# EAGLE design Q1 EAGLE BRD (EAGLE 9.6.0)
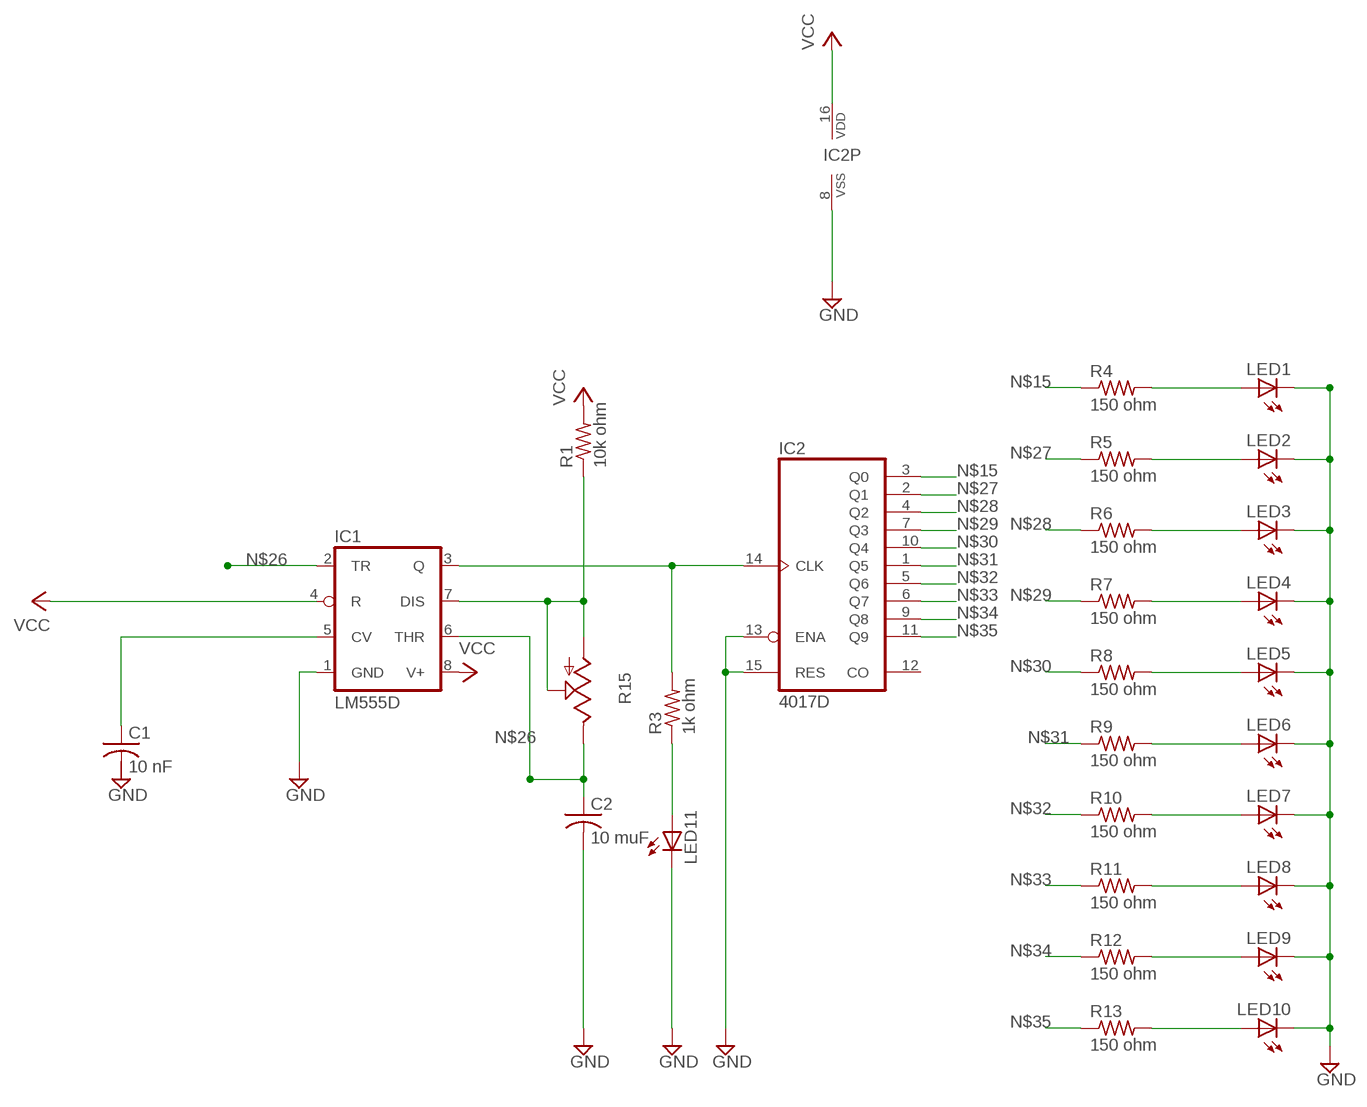
[diagram p0: schematic, sheet 1]

## Parts
C1  10 nF  C-USC0805  [C0805]
C2  10 muF  C-USC0805  [C0805]
IC1  LM555D  [SO08]
IC2  4017D  [SO16]
LED1  LED5MM  [LED5MM]
LED2  LED5MM  [LED5MM]
LED3  LED5MM  [LED5MM]
LED4  LED5MM  [LED5MM]
LED5  LED5MM  [LED5MM]
LED6  LED5MM  [LED5MM]
LED7  LED5MM  [LED5MM]
LED8  LED5MM  [LED5MM]
LED9  LED5MM  [LED5MM]
LED10  LED5MM  [LED5MM]
LED11  LED5MM  [LED5MM]
R1  10k ohm  R-US_M1206  [M1206]
R3  1k ohm  R-US_M1206  [M1206]
R4  150 ohm  R-US_M1206  [M1206]
R5  150 ohm  R-US_M1206  [M1206]
R6  150 ohm  R-US_M1206  [M1206]
R7  150 ohm  R-US_M1206  [M1206]
R8  150 ohm  R-US_M1206  [M1206]
R9  150 ohm  R-US_M1206  [M1206]
R10  150 ohm  R-US_M1206  [M1206]
R11  150 ohm  R-US_M1206  [M1206]
R12  150 ohm  R-US_M1206  [M1206]
R13  150 ohm  R-US_M1206  [M1206]
R15  TRIM_US-S63X  [S63X]

## Nets
GND: C2.2 IC1.1(GND) IC2.8(VSS) IC2.13(ENA) IC2.15(RES) LED1.K(C) LED2.K(C) LED3.K(C) LED4.K(C) LED5.K(C) LED6.K(C) LED7.K(C) LED8.K(C) LED9.K(C) LED10.K(C) LED11.K(C)
N$1: C1.1 IC1.5(CV)
N$3: LED11.A R3.1
N$4: LED1.A R4.2
N$5: LED2.A R5.2
N$6: LED3.A R6.2
N$7: LED4.A R7.2
N$8: LED5.A R8.2
N$9: LED6.A R9.2
N$10: LED7.A R10.2
N$11: LED8.A R11.2
N$12: LED9.A R12.2
N$13: LED10.A R13.2
N$14: IC1.7(DIS) R1.1 R15.A R15.S
N$15: IC2.3(Q0) R4.1
N$25: IC1.3(Q) IC2.14(CLK) R3.2
N$26: C2.1 IC1.2(TR) IC1.6(THR) R15.E
N$27: IC2.2(Q1) R5.1
N$28: IC2.4(Q2) R6.1
N$29: IC2.7(Q3) R7.1
N$30: IC2.10(Q4) R8.1
N$31: IC2.1(Q5) R9.1
N$32: IC2.5(Q6) R10.1
N$33: IC2.6(Q7) R11.1
N$34: IC2.9(Q8) R12.1
N$35: IC2.11(Q9) R13.1
VCC: IC1.4(R) IC1.8(V+) IC2.16(VDD) R1.2
Unconnected: C1.2 IC2.12(CO)

## Library data of the parts
C1 C2 = rcl:C-US: CAPACITOR, American symbol; SPICEPREFIX: C
IC1 = linear:*555: TIMER
IC2 = 40xx:4017: COUNTER/DIVIDER
LED1-LED11 = adafruit:LED: LED OSRAM: - CHIPLED LG R971, LG N971, LY N971, LG Q971, LY Q971, LO R971, LY R971 LH N974, LH R974 LS Q976, LO Q976, LY Q976 LO Q996 - Hyper CHIPLED LW Q18S LB Q993, LB Q99A, LB R99A - SideLED LS A670, LO A670, LY A670, LG A670, LP A670 LB A673, LV A673, LT A673, LW A673 LH A674 LY A675 LS A676, LA A676, LO A676, LY A676, LW A676 LS A679, LY A679, LG A679 - Hyper Micro SIDELED® LS Y876, LA Y876, LO Y876, LY Y876 LT Y87S - SmartLED LW L88C, LW L88S LB L89C, LB L89S, LG L890 LS L89K, LO L89K, LY L89K LS L896, LA L896, LO L896, LY L896 - TOPLED LS T670, LO T670, LY T670, LG T670, LP T670 LSG T670, LSP T670, LSY T670, LOP T670, LYG T670 LG T671, LOG T671, LSG T671 LB T673, LV T673, LT T673, LW T673 LH T674 LS T676, LA T676, LO T676, LY T676, LB T676, LH T676, LSB T676, LW T676 LB T67C, LV T67C, LT T67C, LS T67K, LO T67K, LY T67K, LW E67C LS E67B, LA E67B, LO E67B, LY E67B, LB E67C, LV E67C, LT E67C LW T67C LS T679, LY T679, LG T679 LS T770, LO T770, LY T770, LG T770, LP T770 LB T773, LV T773, LT T773, LW T773 LH T774 LS E675, LA E675, LY E675, LS T675 LS T776, LA T776, LO T776, LY T776, LB T776 LHGB T686 LT T68C, LB T68C - Hyper Mini TOPLED® LB M676 - Mini TOPLED Santana® LG M470 LS M47K, LO M47K, LY M47K Source: http://www.osram.convergy.de/
R1 R3-R13 = adafruit:R-US_: RESISTOR, American symbol
R15 = pot:TRIM_US-: POTENTIOMETER

## Board
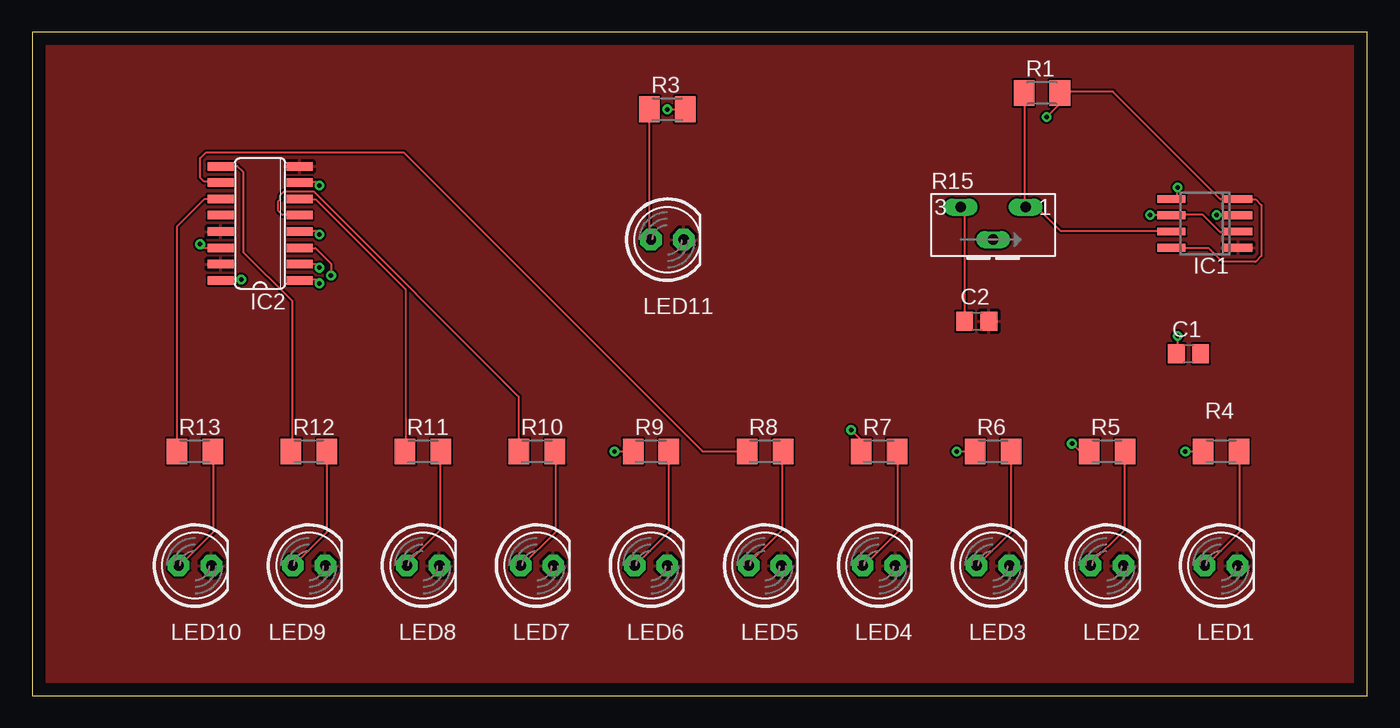
[diagram p1: board, top side]
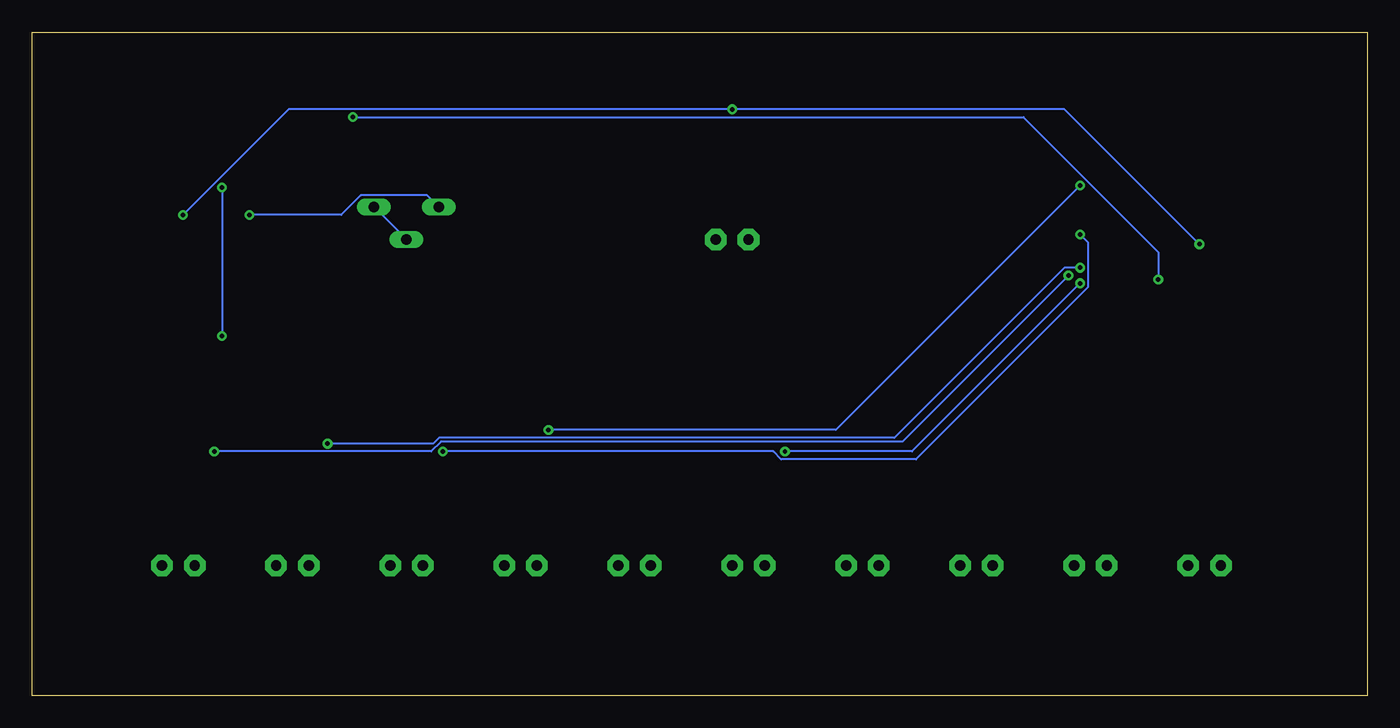
[diagram p2: board, bottom side, seen from below]

Size 104.12 x 51.74 mm. Coordinates in mm from the lower left corner, seen from the top.
Outline: 0,0 104.12,0 104.12,51.74 0,51.74 0,0
Copper layers (1*16): Top 0.035mm / dielectric 1.5mm / Bottom 0.035mm
Design rules "default": minimum track width 6mil, minimum drill 0.35mm, track to track 6mil, track to pad 6mil, pad to pad 6mil, via to via 6mil, smd to smd 6mil, copper to edge 40mil, drill to drill 6mil, minimum pad ring 10mil, minimum via ring 8mil, stop-mask expansion 4mil, vias tented up to drill 0mil, thermal gap 10mil

### Footprints (pad centres in the part's own frame; a part is rotated, then mirrored left to right if it is on the bottom)
C0805 = smd 1.3 x 1.5: 1 -0.95,0; 2 0.95,0
SO08 = smd 0.6 x 2.2: 1 -1.905,-2.6; 2 -0.635,-2.6; 3 0.635,-2.6; 4 1.905,-2.6; 5 1.905,2.6; 6 0.635,2.6; 7 -0.635,2.6; 8 -1.905,2.6
SO16 = smd 0.66 x 2.032: 1 -4.445,-3.073; 2 -3.175,-3.073; 3 -1.905,-3.073; 4 -0.635,-3.073; 5 0.635,-3.073; 6 1.905,-3.073; 7 3.175,-3.073; 8 4.445,-3.073; 9 4.445,3.073; 10 3.175,3.073; 11 1.905,3.073; 12 0.635,3.073; 13 -0.635,3.073; 14 -1.905,3.073; 15 -3.175,3.073; 16 -4.445,3.073
LED5MM = drill 0.813 pad 1.676 octagon: A -1.27,0; K 1.27,0
M1206 = smd 1.6 x 2: 1 -1.4,0; 2 1.4,0
S63X = drill 0.813 long: A 2.54,0; E -2.54,0; S 0,-2.54

### Placement (x,y rotation side)
C1  90.17,26.67 0 top
C2  73.66,29.21 0 top
IC1  91.44,36.83 90 top
IC2  17.78,36.83 90 top
LED1  92.71,10.16 0 top
LED2  83.82,10.16 0 top
LED3  74.93,10.16 0 top
LED4  66.04,10.16 0 top
LED5  57.15,10.16 0 top
LED6  48.26,10.16 0 top
LED7  39.37,10.16 0 top
LED8  30.48,10.16 0 top
LED9  21.59,10.16 0 top
LED10  12.7,10.16 0 top
LED11  49.53,35.56 0 top
R1  78.74,46.99 0 top
R3  49.53,45.72 0 top
R4  92.71,19.05 0 top
R5  83.82,19.05 0 top
R6  74.93,19.05 0 top
R7  66.04,19.05 0 top
R8  57.15,19.05 0 top
R9  48.26,19.05 0 top
R10  39.37,19.05 0 top
R11  30.48,19.05 0 top
R12  21.59,19.05 0 top
R13  12.7,19.05 0 top
R15  74.93,38.1 0 top

### Tracks (layer width: path | path; a pad name or v marks a point on that pad's centre or on a via)
GND
  pour Top: 0,52.07 104.14,52.07 104.14,0 0,0
N$1  (via drill 0.35)
  Top 0.152: v89.31,28.04 89.31,26.67 C1.1 | v89.31,39.62 89.31,39.01 89.15,38.86 88.85,38.86 IC1.5
  Bottom 0.152: v89.31,39.62 v89.31,28.04
N$3
  Top 0.152: R3.1 48.16,45.72 48.16,35.66 LED11.A
N$4
  Top 0.152: R4.2 94.18,19.05 94.18,12.8 91.44,10.06 LED1.A
N$5
  Top 0.152: R5.2 85.19,19.05 85.19,12.95 82.45,10.21 LED2.A
N$6
  Top 0.152: R6.2 76.35,19.05 76.35,12.8 73.76,10.21 LED3.A
N$7
  Top 0.152: R7.2 67.51,19.05 67.51,12.8 64.77,10.06 LED4.A
N$8
  Top 0.152: R8.2 58.52,19.05 58.52,12.95 55.78,10.21 LED5.A
N$9
  Top 0.152: R9.2 49.68,19.05 49.68,12.8 47.09,10.21 LED6.A
N$10
  Top 0.152: R10.2 40.84,19.05 40.84,12.8 38.1,10.06 LED7.A
N$11
  Top 0.152: R11.2 31.85,19.05 31.85,12.95 29.11,10.21 LED8.A
N$12
  Top 0.152: R12.2 23.01,19.05 23.01,12.8 20.42,10.21 LED9.A
N$13
  Top 0.152: R13.2 14.17,19.05 14.17,12.8 11.43,10.06 LED10.A
N$14
  Top 0.152: R1.1 77.42,46.94 77.42,38.1 R15.A 78.33,38.1 80.16,36.27 88.7,36.27 IC1.7
  Bottom 0.152: R15.S 74.98,35.66 77.42,38.1 R15.A
N$15  (via drill 0.35)
  Top 0.152: v89.92,19.05 R4.1 | v23.32,32.77 23.32,33.68 22.1,34.9 20.88,34.9 IC2.3
  Bottom 0.152: v89.92,19.05 73,19.05 72.24,19.81 36.27,19.81 v23.32,32.77
N$25  (via drill 0.35)
  Top 0.152: v49.53,45.72 R3.2 | v13.11,35.2 13.41,34.9 14.63,34.9 IC2.14 | v92.35,37.49 94.03,37.49 IC1.3
  Bottom 0.152: v13.11,35.2 23.62,45.72 v49.53,45.72 84.12,45.72 v92.35,37.49
N$26  (via drill 0.35)
  Top 0.152: IC1.2 94.03,36.12 92.66,36.12 91.29,37.49 88.85,37.49 IC1.6 88.7,37.49 v87.17,37.49 | R15.E 72.69,37.8 72.69,29.26 C2.1
  Bottom 0.152: v87.17,37.49 80.01,37.49 78.49,39.01 73.3,39.01 R15.E
N$27  (via drill 0.35)
  Top 0.152: R5.1 81.69,19.05 v81.08,19.66 | v22.4,33.38 22.1,33.68 20.88,33.68 IC2.2
  Bottom 0.152: v81.08,19.66 72.85,19.66 72.39,20.12 36.88,20.12 23.62,33.38 v22.4,33.38
N$28  (via drill 0.35)
  Top 0.152: v72.08,19.05 R6.1 | v22.4,35.97 22.1,36.27 20.88,36.27 IC2.4
  Bottom 0.152: v72.08,19.05 46.33,19.05 45.72,18.44 35.2,18.44 21.79,31.85 21.79,35.36 v22.4,35.97
N$29  (via drill 0.35)
  Top 0.152: v63.86,20.73 64.62,19.96 64.62,19.05 R7.1 | v22.4,39.78 22.1,40.08 20.88,40.08 IC2.7
  Bottom 0.152: v63.86,20.73 41.45,20.73 v22.4,39.78
N$30
  Top 0.152: R8.1 52.27,19.05 28.96,42.37 13.56,42.37 13.11,41.91 13.11,40.39 13.41,40.08 14.63,40.08 IC2.10
N$31  (via drill 0.35)
  Top 0.152: v45.41,19.05 R9.1 | v22.4,32.16 22.1,32.46 20.88,32.46 IC2.1
  Bottom 0.152: v45.41,19.05 35.51,19.05 v22.4,32.16
N$32
  Top 0.152: R10.1 37.95,19.05 37.95,23.32 21.95,39.32 19.66,39.32 19.36,39.01 19.36,38.71 19.2,38.56 19.2,37.8 19.51,37.49 20.73,37.49 IC2.5
N$33
  Top 0.152: R11.1 29.11,19.05 29.11,31.7 22.1,38.71 20.88,38.71 IC2.6
N$34
  Top 0.152: R12.1 20.27,19.05 20.27,30.79 16.46,34.59 16.46,40.84 16,41.3 14.78,41.3 IC2.9
N$35
  Top 0.152: R13.1 11.28,19.05 11.28,36.58 13.41,38.71 14.63,38.71 IC2.11
VCC  (via drill 0.35)
  Top 0.152: v16.31,32.46 14.78,32.46 IC2.16 | v79.1,45.11 80.01,46.02 80.01,46.94 R1.2 80.16,47.09 84.28,47.09 92.66,38.71 94.03,38.71 IC1.4 94.18,38.71 95.4,38.71 95.86,38.25 95.86,34.29 95.4,33.83 92.81,33.83 91.75,34.9 88.85,34.9 IC1.8
  Bottom 0.152: v16.31,32.46 16.31,34.59 26.82,45.11 v79.1,45.11